# EAGLE design 2020can_master_v4 (EAGLE 9.6.2)
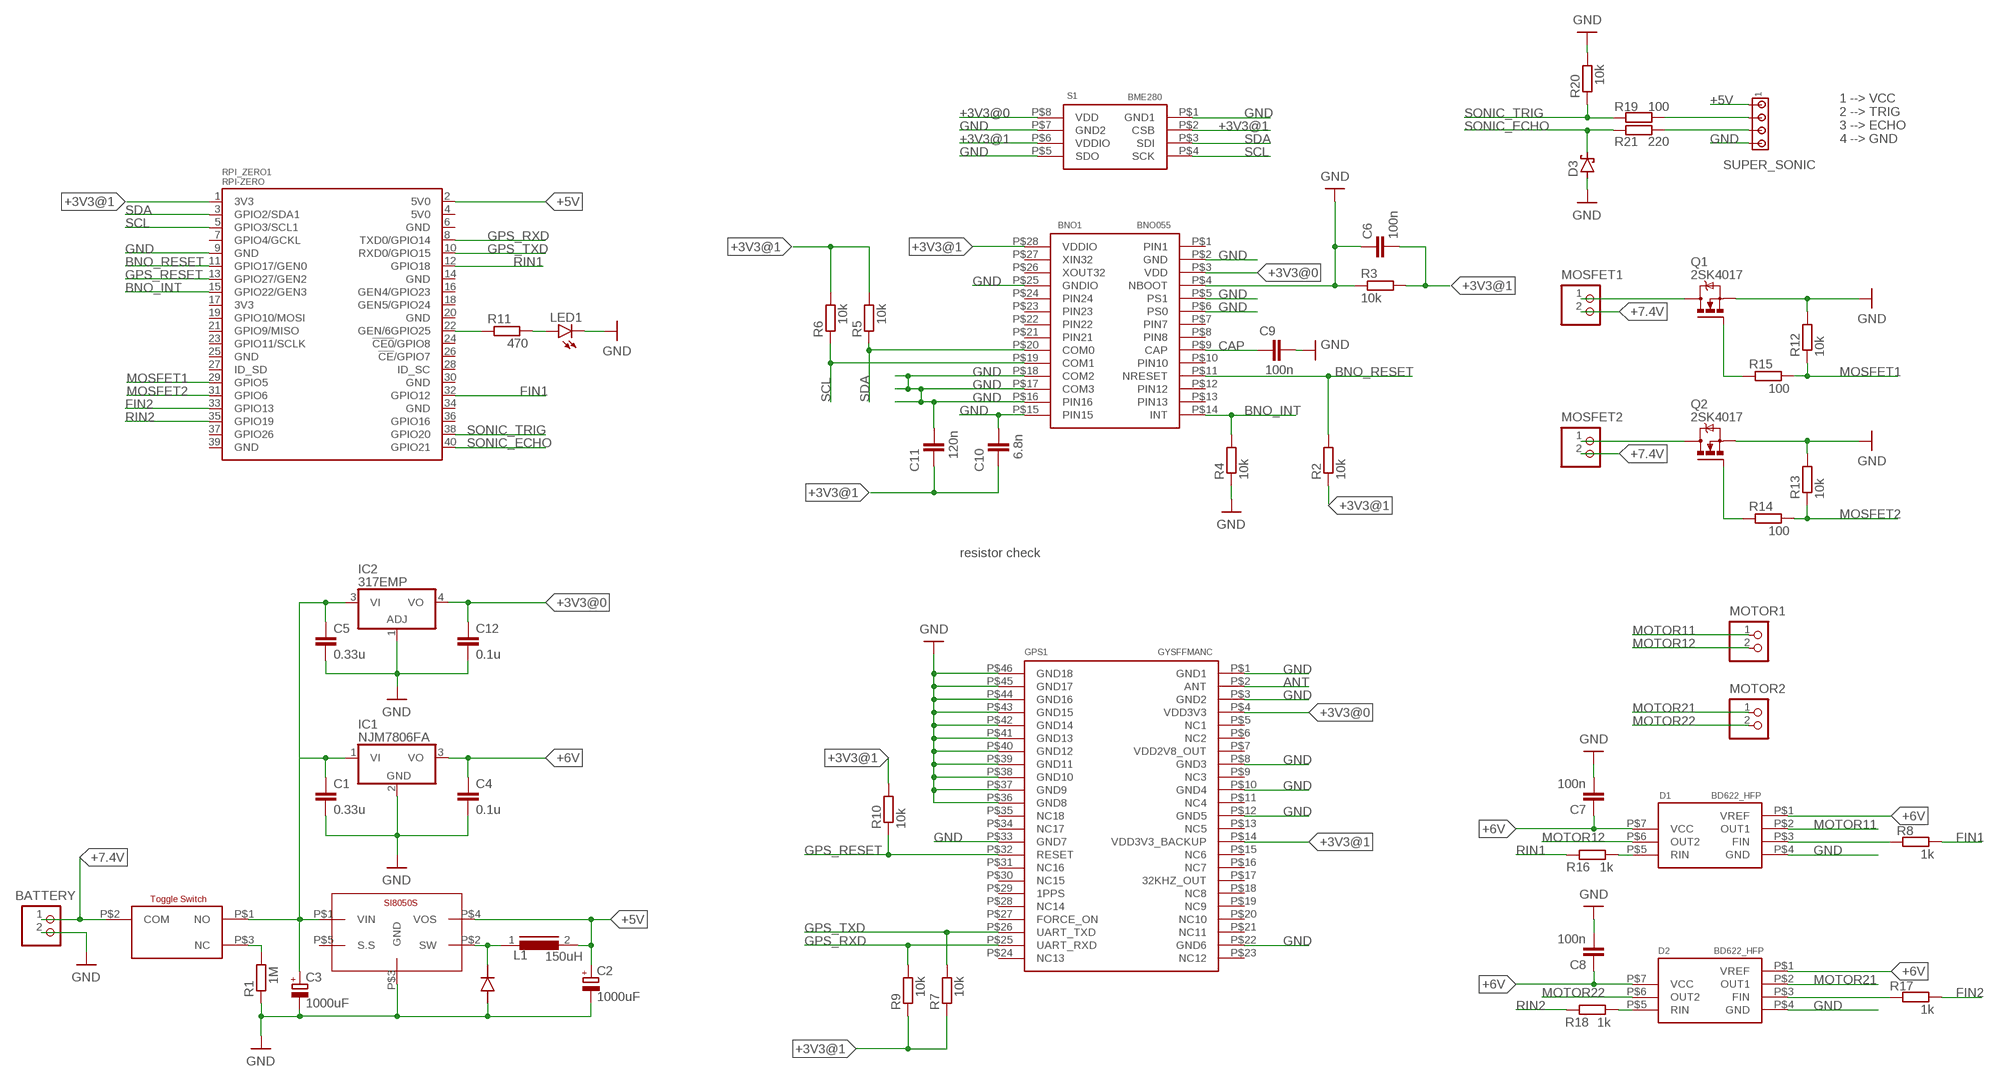
[diagram p0: schematic, sheet 1]

## Parts
BATTERY  B2P-VH  [B2P-VH]
BNO1  BNO055  [BNO055]
C1  0.33u  C5/3  [C5B3]
C2  1000uF  CPOL-EUE5-10.5  [E5-10,5]
C3  1000uF  CPOL-EUE5-10.5  [E5-10,5]
C4  0.1u  C5/3  [C5B3]
C5  0.33u  C5/3  [C5B3]
C6  100n  C-EUC1206  [C1206]
C7  100n  C-EUC1206  [C1206]
C8  100n  C-EUC1206  [C1206]
C9  100n  C-EUC1206  [C1206]
C10  6.8n  C-EUC1206  [C1206]
C11  120n  C-EUC1206  [C1206]
C12  0.1u  C5/3  [C5B3]
D1  BD622_HFP  [BD62**_HRP7]
D2  BD622_HFP  [BD62**_HRP7]
D3  15KEXXD  [DO201T15]
DIODE_1.1  DIODE_1.5  [DIODE_1.5]
GPS1  GYSFFMANC  [GYSFFMANC]
IC1  NJM7806FA  786TV  [TO220V]
IC2  317EMP  [SOT223]
L1  150uH  SFT830D  [SFT830D]
LED1  LED5MM  [LED5MM]
MOSFET1  B2P-VH  [B2P-VH]
MOSFET2  B2P-VH  [B2P-VH]
MOTOR1  B2P-VH  [B2P-VH]
MOTOR2  B2P-VH  [B2P-VH]
Q1  2SK4017  IRF520  [TO220BV]
Q2  2SK4017  IRF520  [TO220BV]
R1  1M  R-EU_R1206  [R1206]
R2  10k  R-EU_R1206  [R1206]
R3  10k  R-EU_R1206  [R1206]
R4  10k  R-EU_R1206  [R1206]
R5  10k  R-EU_R1206  [R1206]
R6  10k  R-EU_R1206  [R1206]
R7  10k  R-EU_R1206  [R1206]
R8  1k  R-EU_R1206  [R1206]
R9  10k  R-EU_R1206  [R1206]
R10  10k  R-EU_R1206  [R1206]
R11  470  R-EU_0207/10  [0207/10]
R12  10k  R-EU_R1206  [R1206]
R13  10k  R-EU_R1206  [R1206]
R14  100  R-EU_0207/10  [0207/10]
R15  100  R-EU_0207/10  [0207/10]
R16  1k  R-EU_R1206  [R1206]
R17  1k  R-EU_R1206  [R1206]
R18  1k  R-EU_R1206  [R1206]
R19  100  R-EU_0207/10  [0207/10]
R20  10k  R-EU_R1206  [R1206]
R21  220  R-EU_0207/10  [0207/10]
RPI_ZERO1  RPI-ZERO  [RASP_PI_ZERO_BOARD_FULL]
S1  BME280  [BME280]
SI8050S1  SI8050S  [SI8050S]
SUPER_SONIC  MTA04-100  [10X04MTA]
SWITCH_2MS1T2B4M2QES1  SWITCH_2MS1T2B4M2QES  [SWITCH_2MS1T2B4M2QES]

## Nets
+3V3@0: BNO1.P$3(VDD) C12.1 GPS1.P$4(VDD3V3) IC2.4(VO) S1.P$8(VDD)
+3V3@1: BNO1.P$28(VDDIO) C6.2 C10.1 C11.1 GPS1.P$14(VDD3V3_BACKUP) R2.1 R3.2 R5.2 R6.2 R7.1 R9.1 R10.2 RPI_ZERO1.1(3V3) S1.P$2(CSB) S1.P$6(VDDIO)
+5V [power]: C2.+ L1.2 RPI_ZERO1.2(5V0) SI8050S1.P$4(VOS) SUPER_SONIC.1
+6V [motor]: C4.1 C7.1 C8.1 D1.P$1(VREF) D1.P$7(VCC) D2.P$1(VREF) D2.P$7(VCC) IC1.3(VO)
+7.4V [power]: BATTERY.1 MOSFET1.2 MOSFET2.2 SWITCH_2MS1T2B4M2QES1.P$2(COM)
ANT [signal]: GPS1.P$2(ANT)
BNO_INT [signal]: BNO1.P$14(INT) R4.2 RPI_ZERO1.15(GPIO22/GEN3)
BNO_RESET [signal]: BNO1.P$11(NRESET) R2.2 RPI_ZERO1.11(GPIO17/GEN0)
CAP [signal]: BNO1.P$9(CAP) C9.1
FIN1 [signal]: R8.1 RPI_ZERO1.32(GPIO12)
FIN2 [signal]: R17.1 RPI_ZERO1.33(GPIO13)
GND: BATTERY.2 BNO1.P$2(GND) BNO1.P$4(NBOOT) BNO1.P$5(PS1) BNO1.P$6(PS0) BNO1.P$15(PIN15) BNO1.P$16(PIN16) BNO1.P$17(COM3) BNO1.P$18(COM2) BNO1.P$25(GNDIO) C1.2 C2.- C3.- C4.2 C5.2 C6.1 C7.2 C8.2 C9.2 C10.2 C11.2 C12.2 D1.P$4(GND) D2.P$4(GND) D3.A DIODE_1.1.P$1(ANODE) GPS1.P$1(GND1) GPS1.P$3(GND2) GPS1.P$8(GND3) GPS1.P$10(GND4) GPS1.P$12(GND5) GPS1.P$22(GND6) GPS1.P$33(GND7) GPS1.P$36(GND8) GPS1.P$37(GND9) GPS1.P$38(GND10) GPS1.P$39(GND11) GPS1.P$40(GND12) GPS1.P$41(GND13) GPS1.P$42(GND14) GPS1.P$43(GND15) GPS1.P$44(GND16) GPS1.P$45(GND17) GPS1.P$46(GND18) IC1.2(GND) IC2.1(ADJ) LED1.K(C) Q1.S Q2.S R1.1 R3.1 R4.1 R12.2 R13.2 R20.2 RPI_ZERO1.9(GND) S1.P$1(GND1) S1.P$5(SDO) S1.P$7(GND2) SI8050S1.P$3(GND) SUPER_SONIC.4
GPS_RESET [signal]: GPS1.P$32(RESET) R10.1 RPI_ZERO1.13(GPIO27/GEN2)
GPS_RXD [signal]: GPS1.P$25(UART_RXD) R9.2 RPI_ZERO1.8(TXD0/GPIO14)
GPS_TXD [signal]: GPS1.P$26(UART_TXD) R7.2 RPI_ZERO1.10(RXD0/GPIO15)
MOSFET1: R12.1 R15.2 RPI_ZERO1.29(GPIO5)
MOSFET2: R13.1 R14.2 RPI_ZERO1.31(GPIO6)
MOTOR11 [motor]: D1.P$2(OUT1) MOTOR1.1
MOTOR12 [motor]: D1.P$6(OUT2) MOTOR1.2
MOTOR21 [motor]: D2.P$2(OUT1) MOTOR2.1
MOTOR22 [motor]: D2.P$6(OUT2) MOTOR2.2
N$1: R1.2 SWITCH_2MS1T2B4M2QES1.P$3(NC)
N$2 [motor]: DIODE_1.1.P$2(CATHODE) L1.1 SI8050S1.P$2(SW)
N$3 [signal]: R11.1 RPI_ZERO1.22(GEN/6GPIO25)
N$4 [power]: C1.1 C3.+ C5.1 IC1.1(VI) IC2.3(VI) SI8050S1.P$1(VIN) SWITCH_2MS1T2B4M2QES1.P$1(NO)
N$5 [signal]: LED1.A R11.2
N$6: MOSFET1.1 Q1.D
N$7: D1.P$3(FIN) R8.2
N$8: MOSFET2.1 Q2.D
N$9: D1.P$5(RIN) R16.1
N$10: Q1.G R15.1
N$11: Q2.G R14.1
N$12: D2.P$3(FIN) R17.2
N$14: D2.P$5(RIN) R18.1
N$15: R19.2 SUPER_SONIC.2
N$16: R21.2 SUPER_SONIC.3
RIN1 [signal]: R16.2 RPI_ZERO1.12(GPIO18)
RIN2 [signal]: R18.2 RPI_ZERO1.35(GPIO19)
SCL [signal]: BNO1.P$19(COM1) R6.1 RPI_ZERO1.5(GPIO3/SCL1) S1.P$4(SCK)
SDA [signal]: BNO1.P$20(COM0) R5.1 RPI_ZERO1.3(GPIO2/SDA1) S1.P$3(SDI)
SONIC_ECHO: D3.C R21.1 RPI_ZERO1.40(GPIO21)
SONIC_TRIG: R19.1 R20.1 RPI_ZERO1.38(GPIO20)
Unconnected: BNO1.P$1(PIN1) BNO1.P$7(PIN7) BNO1.P$8(PIN8) BNO1.P$10(PIN10) BNO1.P$12(PIN12) BNO1.P$13(PIN13) BNO1.P$21(PIN21) BNO1.P$22(PIN22) BNO1.P$23(PIN23) BNO1.P$24(PIN24) BNO1.P$26(XOUT32) BNO1.P$27(XIN32) GPS1.P$5(NC1) GPS1.P$6(NC2) GPS1.P$7(VDD2V8_OUT) GPS1.P$9(NC3) GPS1.P$11(NC4) GPS1.P$13(NC5) GPS1.P$15(NC6) GPS1.P$16(NC7) GPS1.P$17(32KHZ_OUT) GPS1.P$18(NC8) GPS1.P$19(NC9) GPS1.P$20(NC10) GPS1.P$21(NC11) GPS1.P$23(NC12) GPS1.P$24(NC13) GPS1.P$27(FORCE_ON) GPS1.P$28(NC14) GPS1.P$29(1PPS) GPS1.P$30(NC15) GPS1.P$31(NC16) GPS1.P$34(NC17) GPS1.P$35(NC18) RPI_ZERO1.4(5V0) RPI_ZERO1.6(GND) RPI_ZERO1.7(GPIO4/GCKL) RPI_ZERO1.14(GND) RPI_ZERO1.16(GEN4/GPIO23) RPI_ZERO1.17(3V3) RPI_ZERO1.18(GEN5/GPIO24) RPI_ZERO1.19(GPIO10/MOSI) RPI_ZERO1.20(GND) RPI_ZERO1.21(GPIO9/MISO) RPI_ZERO1.23(GPIO11/SCLK) RPI_ZERO1.24(!CE0!/GPIO8) RPI_ZERO1.25(GND) RPI_ZERO1.26(!CE!/GPIO7) RPI_ZERO1.27(ID_SD) RPI_ZERO1.28(ID_SC) RPI_ZERO1.30(GND) RPI_ZERO1.34(GND) RPI_ZERO1.36(GPIO16) RPI_ZERO1.37(GPIO26) RPI_ZERO1.39(GND) SI8050S1.P$5(S.S)

## Notes on the sheet
- 1 --> VCC
  2 --> TRIG
  3 --> ECHO
  4 --> GND
- resistor check

## Library data of the parts
BATTERY MOSFET1 MOSFET2 MOTOR1 MOTOR2 = CONN_VH:B2P-VH: Wire-to-Board 3.96mm pitch top mount connector Source: http://www.jst-mfg.com/product/pdf/jpn/VH.pdf http://www.jst-mfg.com/product/detail.php?series=262
BNO1 = BNO055:BNO055
C1 C4 C5 C12 = capacitor-wima:C: CAPACITOR naming: grid - package width
C2 C3 = resistor:CPOL-EU: POLARIZED CAPACITOR, European symbol
C6-C11 = rcl:C-EU: CAPACITOR, European symbol; SPICEPREFIX: C
D1 D2 = BD62_:BD622*_HFP
D3 = diode:15KEXXD: DIODE
DIODE_1.1 = diode_1.5mm:DIODE_1.5
GPS1 = GPS:GYSFFMANC
IC1 = linear:78*: Positive VOLTAGE REGULATOR Source: http://cache.national.com/ds/LM/LM78L05.pdf http://www.fairchildsemi.com/ds/LM/LM7805.pdf
IC2 = linear:*317: Positive VOLTAGE REGULATOR
L1 = inductors:SFT830D: INDUCTOR; SPICEPREFIX: L
LED1 = led:LED: LED OSRAM: - CHIPLED LG R971, LG N971, LY N971, LG Q971, LY Q971, LO R971, LY R971 LH N974, LH R974 LS Q976, LO Q976, LY Q976 LO Q996 - Hyper CHIPLED LW Q18S LB Q993, LB Q99A, LB R99A - SideLED LS A670, LO A670, LY A670, LG A670, LP A670 LB A673, LV A673, LT A673, LW A673 LH A674 LY A675 LS A676, LA A676, LO A676, LY A676, LW A676 LS A679, LY A679, LG A679 - Hyper Micro SIDELED® LS Y876, LA Y876, LO Y876, LY Y876 LT Y87S - SmartLED LW L88C, LW L88S LB L89C, LB L89S, LG L890 LS L89K, LO L89K, LY L89K LS L896, LA L896, LO L896, LY L896 - TOPLED LS T670, LO T670, LY T670, LG T670, LP T670 LSG T670, LSP T670, LSY T670, LOP T670, LYG T670 LG T671, LOG T671, LSG T671 LB T673, LV T673, LT T673, LW T673 LH T674 LS T676, LA T676, LO T676, LY T676, LB T676, LH T676, LSB T676, LW T676 LB T67C, LV T67C, LT T67C, LS T67K, LO T67K, LY T67K, LW E67C LS E67B, LA E67B, LO E67B, LY E67B, LB E67C, LV E67C, LT E67C LW T67C LS T679, LY T679, LG T679 LS T770, LO T770, LY T770, LG T770, LP T770 LB T773, LV T773, LT T773, LW T773 LH T774 LS E675, LA E675, LY E675, LS T675 LS T776, LA T776, LO T776, LY T776, LB T776 LHGB T686 LT T68C, LB T68C - Hyper Mini TOPLED® LB M676 - Mini TOPLED Santana® LG M470 LS M47K, LO M47K, LY M47K Source: http://www.osram.convergy.de LUXEON: - LUMILED® LXK2-PW12-R00, LXK2-PW12-S00, LXK2-PW14-U00, LXK2-PW14-V00 LXK2-PM12-R00, LXK2-PM12-S00, LXK2-PM14-U00 LXK2-PE12-Q00, LXK2-PE12-R00, LXK2-PE12-S00, LXK2-PE14-T00, LXK2-PE14-U00 LXK2-PB12-K00, LXK2-PB12-L00, LXK2-PB12-M00, LXK2-PB14-N00, LXK2-PB14-P00, LXK2-PB14-Q00 LXK2-PR12-L00, LXK2-PR12-M00, LXK2-PR14-Q00, LXK2-PR14-R00 LXK2-PD12-Q00, LXK2-PD12-R00, LXK2-PD12-S00 LXK2-PH12-R00, LXK2-PH12-S00 LXK2-PL12-P00, LXK2-PL12-Q00, LXK2-PL12-R00 Source: www.luxeon.com KINGBRIGHT: KA-3528ASYC Source: www.kingbright.com
Q1 Q2 = transistor-power:IRF520: HEXFET Power MOSFET
R1-R21 = rcl:R-EU_: RESISTOR, European symbol; SPICEPREFIX: R
RPI_ZERO1 = RaspberryPi_Zero:RPI-ZERO: MICON
S1 = BME280:BME280
SI8050S1 = SI-8050S:SI8050S
SUPER_SONIC = con-amp:MTA04-100: AMP connector
SWITCH_2MS1T2B4M2QES1 = switch_2MS1T2B4M2QES:SWITCH_2MS1T2B4M2QES

## Net classes
0 default: width 0.2 mm, clearance 0.05 mm
1 power: width 1.5 mm, clearance 0.2 mm
2 mos: width 1.5 mm, clearance 0.2 mm
3 signal: width 0.2 mm, clearance 0.05 mm
4 motor: width 0.8 mm, clearance 0.1 mm

## Board
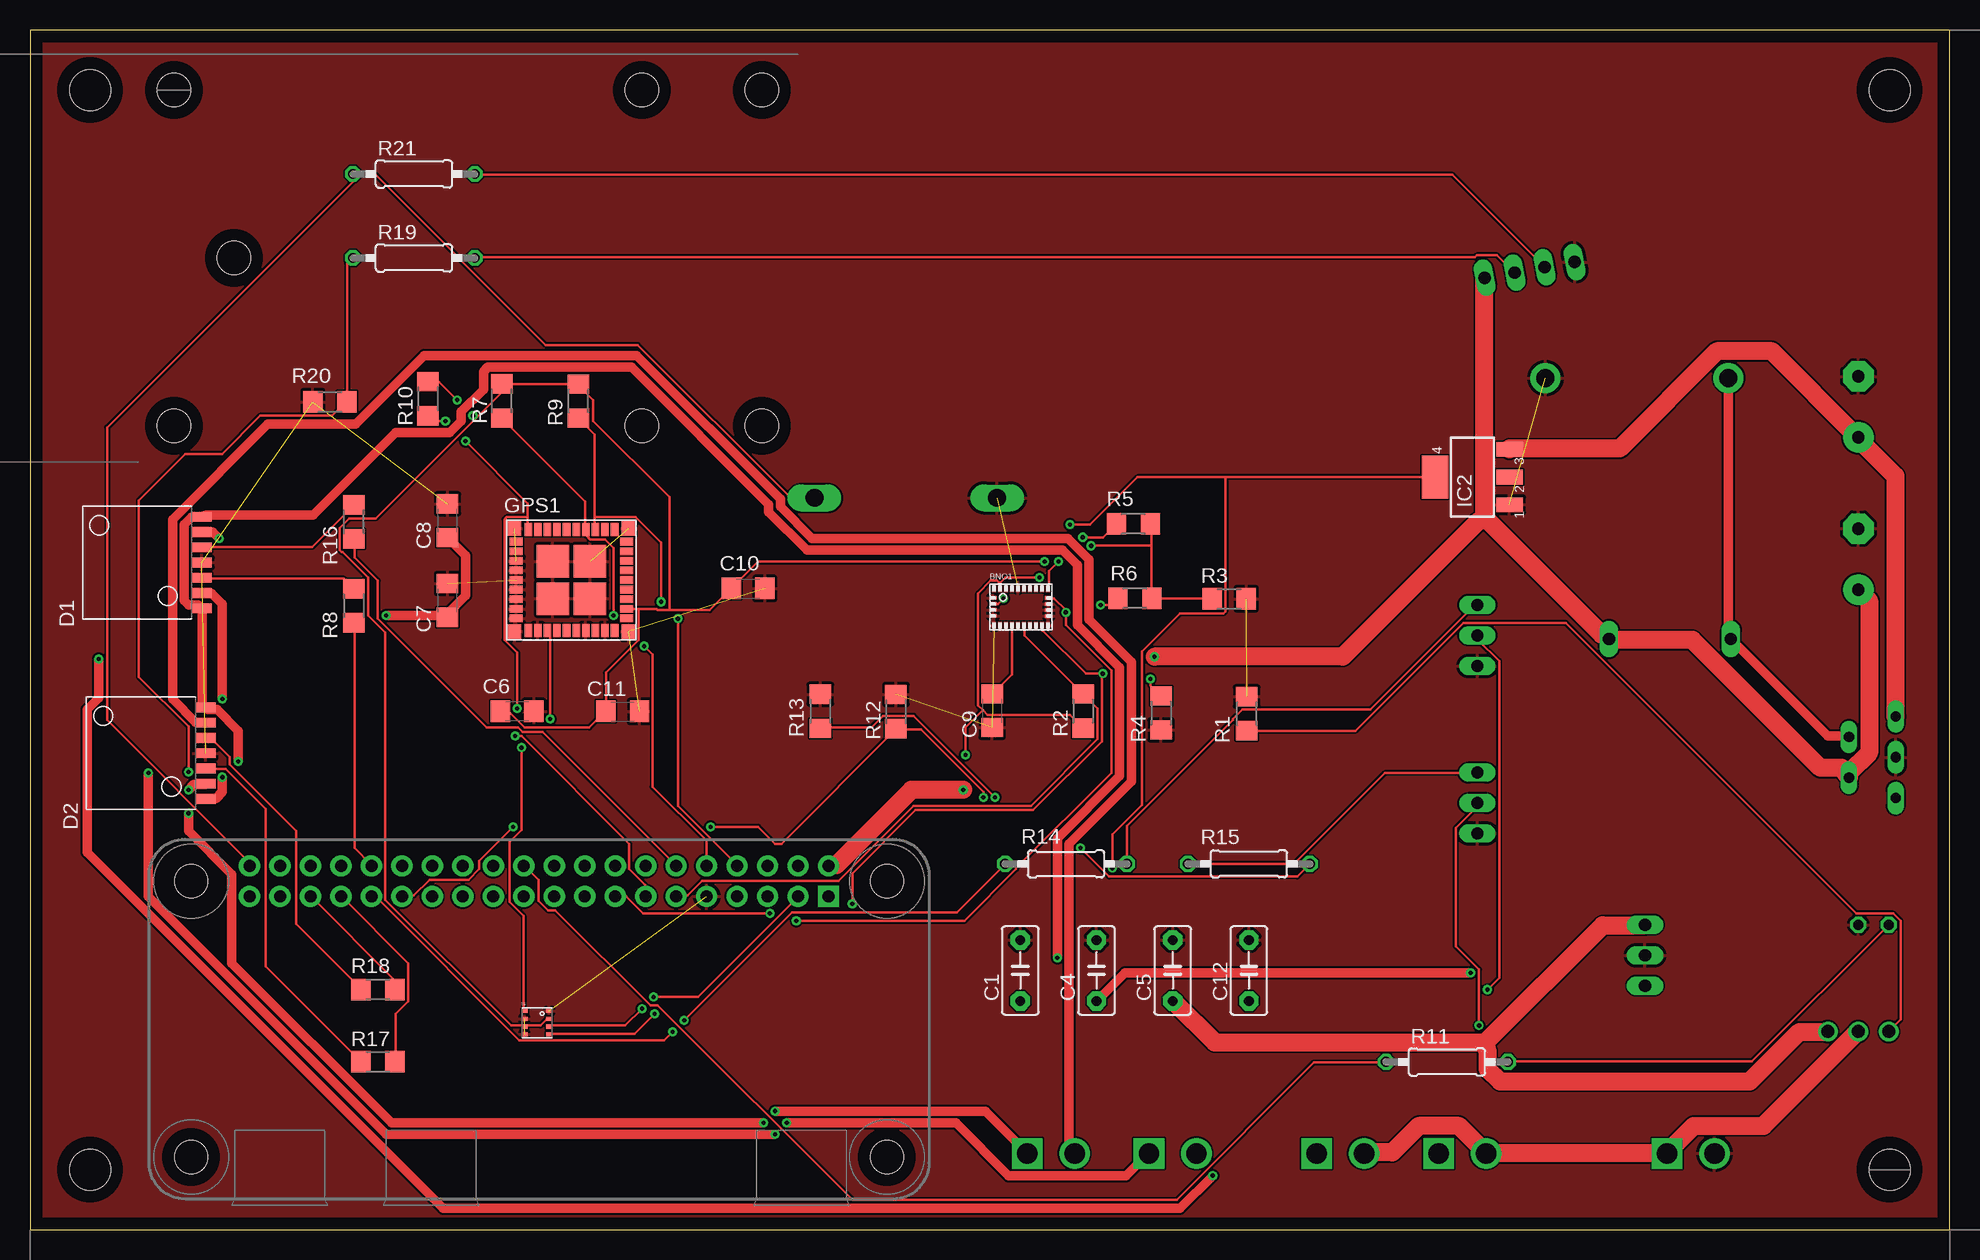
[diagram p1: board, top side]
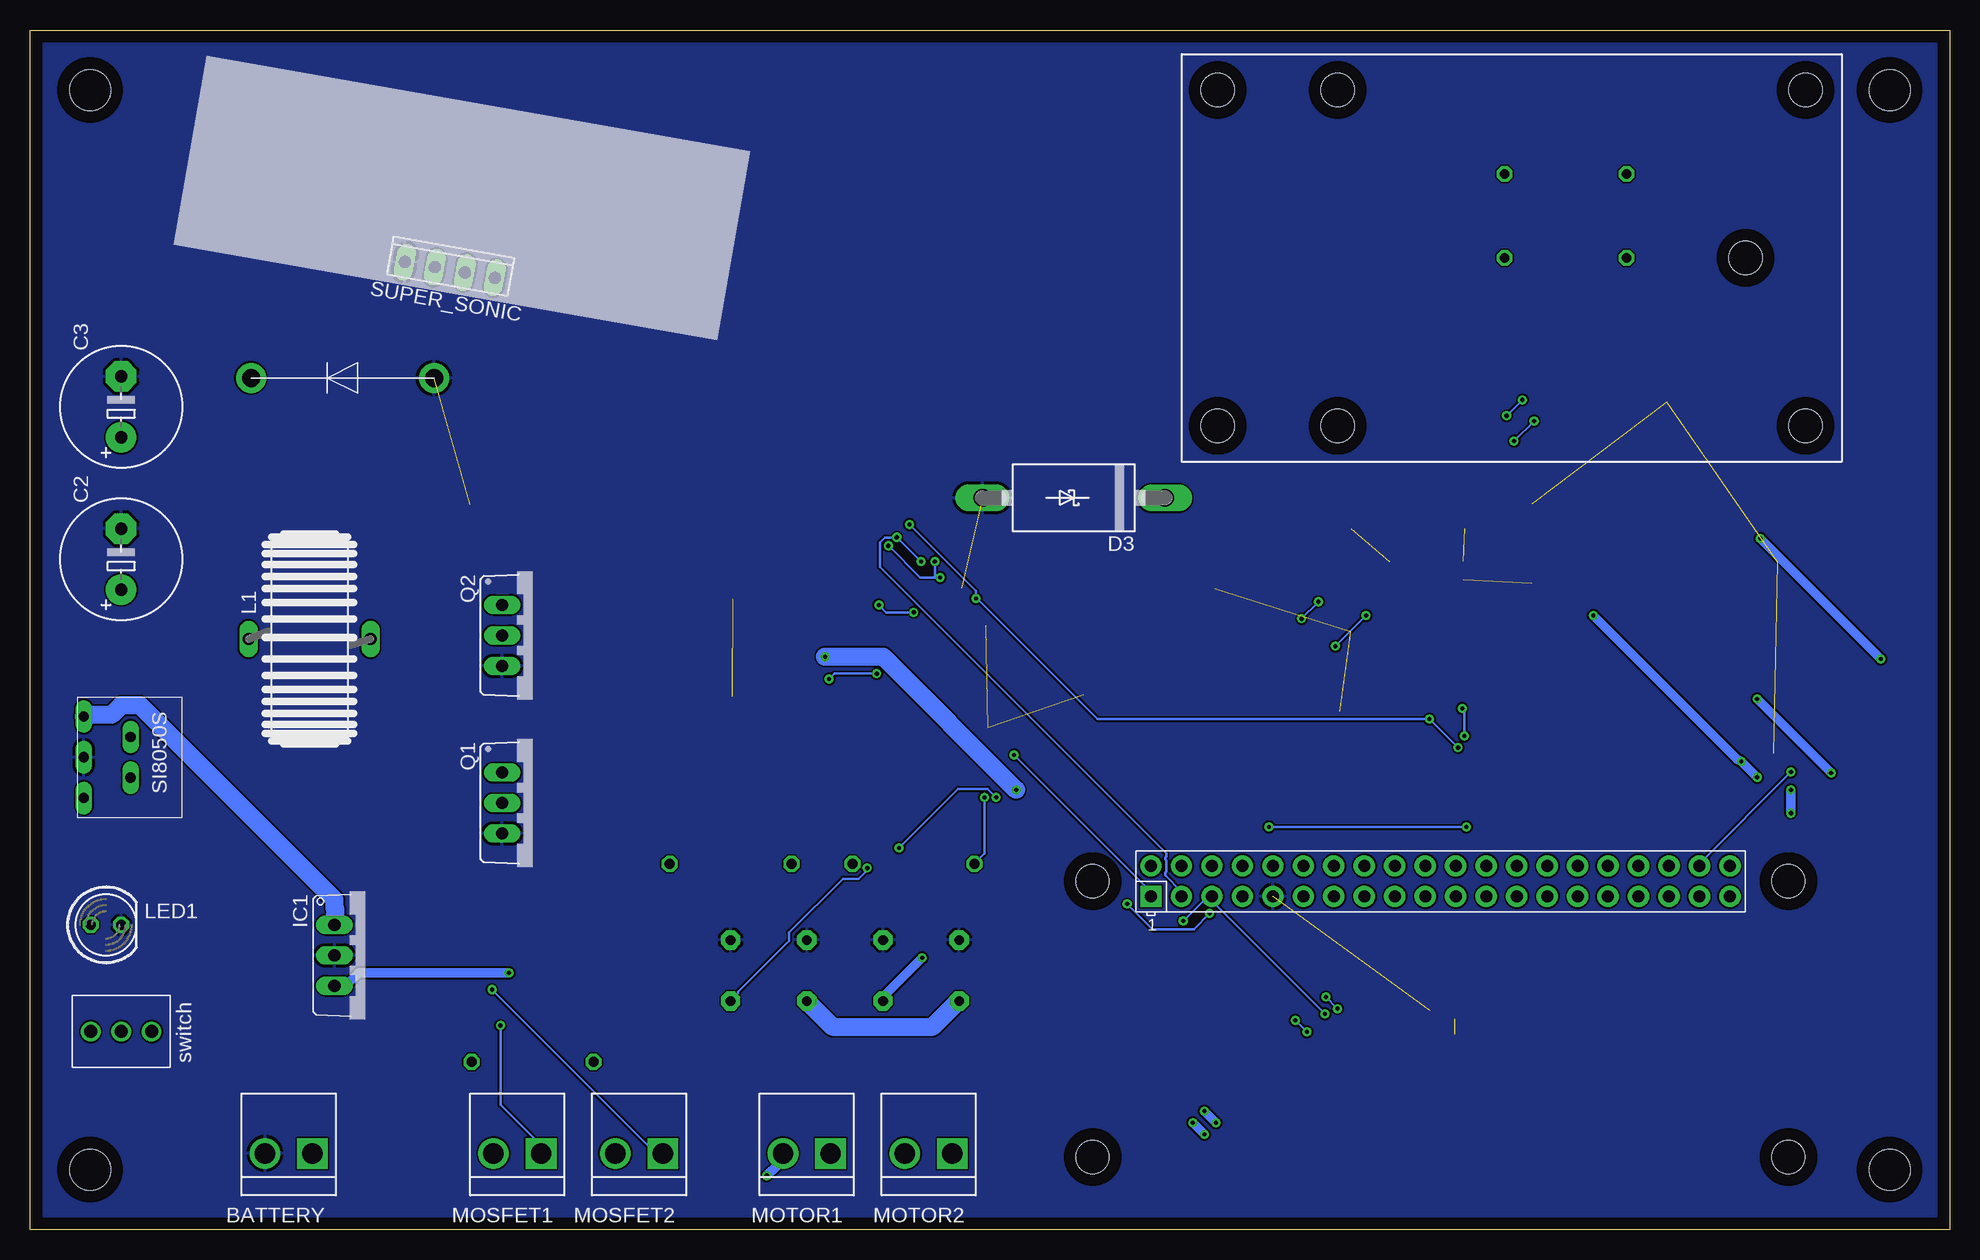
[diagram p2: board, bottom side, seen from below]

Size 160 x 100 mm. Coordinates in mm from the lower left corner, seen from the top.
Outline: 0,0 160,0 160,100 0,100 0,0
Copper layers (1*16): Top 0.035mm / dielectric 1.5mm / Bottom 0.035mm
Design rules "default": minimum track width 6mil, minimum drill 0.35mm, track to track 6mil, track to pad 6mil, pad to pad 6mil, via to via 6mil, smd to smd 6mil, copper to edge 40mil, drill to drill 6mil, minimum pad ring 10mil, minimum via ring 8mil, stop-mask expansion 4mil, vias tented up to drill 0mil, thermal gap 10mil
Holes 3.4 mm at 5,5 5,95 155,5 155,95
Holes 2.8 mm at 12,67 12,95 51,95 61,95 61,67 51,67 17,81

### Footprints (pad centres in the part's own frame; a part is rotated, then mirrored left to right if it is on the bottom)
B2P-VH = drill 1.7 square: 1 -1.98,0 | drill 1.7: 2 1.98,0
BNO055 = smd 0.305 x 0.61: P$1 0.35,3.47; P$6 0.355,0.35; P$7 0.855,0.35; P$8 1.355,0.35; P$9 1.855,0.35; P$10 2.355,0.35; P$11 2.855,0.35; P$12 3.355,0.35; P$13 3.855,0.35; P$14 4.355,0.35; P$15 4.855,0.35; P$20 4.85,3.47; P$21 4.35,3.47; P$22 3.85,3.47; P$23 3.35,3.47; P$24 2.85,3.47; P$25 2.35,3.47; P$26 1.85,3.47; P$27 1.35,3.47; P$28 0.85,3.47 | smd 0.61 x 0.305: P$2 0.275,2.655; P$3 0.275,2.155; P$4 0.275,1.655; P$5 0.275,1.155; P$16 4.915,1.15; P$17 4.915,1.65; P$18 4.915,2.15; P$19 4.915,2.65
C5B3 = drill 0.813 pad 1.6 octagon: 1 -2.54,0; 2 2.54,0
E5-10,5 = drill 1.016 pad 2.54: + -2.54,0 | drill 1.016 pad 2.54 octagon: - 2.54,0
C1206 = smd 1.6 x 1.8: 1 -1.4,0; 2 1.4,0
BD62**_HRP7 = smd 0.813 x 1.676: P$1 0.887,-0.835; P$2 2.158,-0.835; P$3 3.428,-0.835; P$4 4.697,-0.835; P$5 5.968,-0.835; P$6 7.237,-0.835; P$7 8.508,-0.835
DO201T15 = drill 1.499 long: A 7.62,0; C -7.62,0
DIODE_1.5 = drill 1.5 pad 2.5: P$1 -7.62,0; P$2 7.62,0
GYSFFMANC = smd 1.2 x 1.1: P$1 0.7,10.15; P$12 0.7,0.65; P$22 9.3,0.65; P$33 9.3,10.15 | smd 1.1 x 0.635: P$2 0.8,9; P$3 0.8,8.2; P$4 0.8,7.4; P$5 0.8,6.6; P$6 0.8,5.8; P$7 0.8,5; P$8 0.8,4.2; P$9 0.8,3.4; P$10 0.8,2.6; P$11 0.8,1.8; P$23 9.2,1.8; P$24 9.2,2.6; P$25 9.2,3.4; P$26 9.2,4.2; P$27 9.2,5; P$28 9.2,5.8; P$29 9.2,6.6; P$30 9.2,7.4; P$31 9.2,8.2; P$32 9.2,9 | smd 0.635 x 1.1: P$13 1.8,0.8; P$14 2.6,0.8; P$15 3.4,0.8; P$16 4.2,0.8; P$17 5,0.8; P$18 5.8,0.8; P$19 6.6,0.8; P$20 7.4,0.8; P$21 8.2,0.8; P$34 8.2,10; P$35 7.4,10; P$36 6.6,10; P$37 5.8,10; P$38 5,10; P$39 4.2,10; P$40 3.4,10; P$41 2.6,10; P$42 1.8,10 | smd 2.7 x 2.7: P$43 3.45,6.95; P$44 3.45,3.85; P$45 6.55,3.85; P$46 6.55,6.95
TO220V = drill 1.016 long: 1 -2.54,-2.54; 2 0,-2.54; 3 2.54,-2.54
SOT223 = smd 1.219 x 2.235: 1 -2.311,-3.099; 2 0,-3.099; 3 2.311,-3.099 | smd 3.6 x 2.2: 4 0,3.099
SFT830D = drill 1.016 long: 1 -5.08,0; 2 5.08,0
LED5MM = drill 0.813 octagon: A -1.27,0; K 1.27,0
TO220BV = drill 1.016 long: D 0,-2.54; G -2.54,-2.54; S 2.54,-2.54
R1206 = smd 1.6 x 1.803: 1 -1.422,0; 2 1.422,0
0207/10 = drill 0.813 octagon: 1 -5.08,0; 2 5.08,0
RASP_PI_ZERO_BOARD_FULL = drill 1 pad 1.778 square: 1 8.37,25.23 | drill 1 pad 1.778: 2 8.37,27.77; 3 10.91,25.23; 4 10.91,27.77; 5 13.45,25.23; 6 13.45,27.77; 7 15.99,25.23; 8 15.99,27.77; 9 18.53,25.23; 10 18.53,27.77; 11 21.07,25.23; 12 21.07,27.77; 13 23.61,25.23; 14 23.61,27.77; 15 26.15,25.23; 16 26.15,27.77; 17 28.69,25.23; 18 28.69,27.77; 19 31.23,25.23; 20 31.23,27.77; 21 33.77,25.23; 22 33.77,27.77; 23 36.31,25.23; 24 36.31,27.77; 25 38.85,25.23; 26 38.85,27.77; 27 41.39,25.23; 28 41.39,27.77; 29 43.93,25.23; 30 43.93,27.77; 31 46.47,25.23; 32 46.47,27.77; 33 49.01,25.23; 34 49.01,27.77; 35 51.55,25.23; 36 51.55,27.77; 37 54.09,25.23; 38 54.09,27.77; 39 56.63,25.23; 40 56.63,27.77 | hole 2.75: 3.5,3.5; 3.5,26.5; 61.5,3.5; 61.5,26.5
BME280 = smd 0.5 x 0.35: P$1 2.275,2.225; P$2 2.275,1.575; P$3 2.275,0.925; P$4 2.275,0.275; P$5 0.225,0.275; P$6 0.225,0.925; P$7 0.225,1.575; P$8 0.225,2.225
SI8050S = drill 0.85 pad 0.9 long: P$1 -3.4,-8.2; P$2 -1.7,-4.3; P$3 0,-8.2; P$4 1.7,-4.3; P$5 3.4,-8.2
10X04MTA = drill 1.016 long: 1 3.81,0; 2 1.27,0; 3 -1.27,0; 4 -3.81,0
SWITCH_2MS1T2B4M2QES = drill 1.09: P$1 0,2.54; P$2 0,0; P$3 0,-2.54

### Placement (x,y rotation side)
BATTERY  138.43,6.35 180 bottom
BNO1  80,50 0 top
C1  82.55,21.59 90 top
C2  152.4,55.88 90 bottom
C3  152.4,68.58 90 bottom
C4  88.9,21.59 90 top
C5  95.25,21.59 90 top
C6  40.6,43.2 180 top
C7  34.8,52.45 90 top
C8  34.8,59.1 90 top
C9  80.2,43.25 270 top
C10  59.85,53.45 0 top
C11  49.4,43.2 0 top
C12  101.6,21.59 90 top
D1  13.48,50.91 90 top
D2  13.8,35.01 90 top
D3  73,61 180 bottom
DIODE_1.1  133.95,70.99 180 bottom
GPS1  50.53,49.15 90 top
IC1  132.08,22.86 270 bottom
IC2  120.23,62.73 90 top
L1  136.7,49.23 0 bottom
LED1  153.67,25.4 0 bottom
MOSFET1  119.38,6.35 180 bottom
MOSFET2  109.22,6.35 180 bottom
MOTOR1  95.25,6.35 180 bottom
MOTOR2  85.09,6.35 180 bottom
Q1  118.11,35.56 270 bottom
Q2  118.11,49.53 270 bottom
R1  101.42,43 270 top
R2  87.78,43.22 90 top
R3  99.96,52.58 180 top
R4  94.28,43.06 90 top
R5  91.98,58.82 0 top
R6  92.1,52.62 0 top
R7  39.32,69.08 270 top
R8  27,52 90 top
R9  45.72,69.06 270 top
R10  33.18,69.26 90 top
R11  118.11,13.97 0 top
R12  72.18,43.18 90 top
R13  65.88,43.2 90 top
R14  86.36,30.48 180 top
R15  101.6,30.48 0 top
R16  27,59 270 top
R17  29,14 180 top
R18  29,20 0 top
R19  32,81 0 top
R20  25,69 180 top
R21  32,88 0 top
RPI_ZERO1  74.93,2.54 0 bottom
S1  41,16 0 top
SI8050S1  147.32,39.37 270 bottom
SUPER_SONIC  125,80 350 bottom
SWITCH_2MS1T2B4M2QES1  152.4,16.51 270 bottom

### Tracks (layer width: path | path; a pad name or v marks a point on that pad's centre or on a via)
+3V3@0  (via drill 0.35)
  Top 0.2: v40.97,40.17 40.97,33.3 40,32.33 40,27.31 41.14,26.17 41.14,18.24 S1.P$8 | v43.34,42.55 43.34,49.69 43.17,49.87 GPS1.P$4 | v81.14,52.6 80.7,52.16 80.35,52.16 BNO1.P$3 | v86.69,58.76 88.36,58.76 92.33,62.73 99.64,62.73 | 99.64,62.73 117.08,62.73 IC2.4 | v90.21,30.13 90.21,32.95 92.68,35.42 92.68,48.19 95.85,51.36 99.47,51.36 99.64,51.54 99.64,62.73
  Bottom 0.2: v40.97,40.17 v43.34,42.55 71.01,42.55 81.05,52.6 v81.14,52.6 81.14,53.21 v86.69,58.76 | v90.21,30.13 90.21,29.95 90.92,29.25 92.24,29.25 96.73,24.76 96.73,24.05 100.96,19.82 100.96,19.73 101.58,19.12 C12.1
+3V3@1  (via drill 0.35)
  Top 0.2: R3.2 98.5,52.6 93.56,52.6 R6.2 93.47,52.68 93.47,57 | 93.47,57 93.47,58.76 R5.2 | 80.79,53.92 80.79,53.48 BNO1.P$28 | 80.79,53.92 80.61,54.09 80.08,54.09 79.03,53.04 79.03,43.7 79.42,43.3 | 79.42,43.3 79.82,42.91 86.69,42.91 87.75,41.85 R2.1 | v77.97,39.56 77.97,41.85 79.42,43.3 | v88.45,57 93.47,57 | v84.14,54.36 81.32,54.36 80.88,53.92 80.79,53.92 | C6.2 39.2,43.17 39.91,43.17 41.23,41.85 46.6,41.85 47.93,43.17 C11.1 48.01,43.26 48.01,46.43 50.75,49.16 50.75,51.72 | 50.75,51.72 52.24,51.72 52.33,51.63 53.3,51.63 | 50.75,51.72 49.78,51.72 GPS1.P$14 | 53.3,51.63 56.65,51.63 58.41,53.39 C10.1 58.5,53.48 60.7,55.68 v84.58,55.68 | S1.P$2 43.26,17.53 43.08,17.53 42.55,17 41.23,17 S1.P$6 41.14,17 40.09,17 29.6,27.49 29.6,49.78 28.19,51.19 28.19,54.36 26.08,56.47 25.99,56.47 25.81,56.65 25.81,58.5 26.61,59.29 28.81,59.29 37.13,67.62 | 37.13,67.62 39.29,69.78 39.29,70.48 R7.1 39.38,70.48 45.64,70.48 R9.1 45.72,70.39 46.96,69.16 46.96,67.4 53.3,61.05 53.3,51.63 | v35.59,69.16 34.09,70.66 33.21,70.66 R10.2 | 37.13,67.62 v36.91,67.84
  Bottom 0.2: v77.97,39.56 66.6,28.19 66.6,27.84 RPI_ZERO1.1 | v88.45,57 85.81,54.36 84.58,54.36 | v84.14,54.36 84.58,54.36 | v36.91,67.84 v35.59,69.16 | v84.58,55.68 84.58,54.36
+5V  (via drill 0.35)
  Top 1.5: C2.+ 152.41,53.3 153.29,52.42 153.29,39.73 151.62,38.06 151.62,37.71 SI8050S1.P$4 151,38.5 149.24,38.5 138.58,49.16 131.62,49.16 L1.2 131,49.6 121.23,59.38 | 121.23,59.38 121.23,79.29 SUPER_SONIC.1 | v77.79,36.65 73.47,36.65 67.22,30.39 66.6,30.39 RPI_ZERO1.2 | v93.74,47.75 109.42,47.75 120.61,58.94 121.23,59.38
  Bottom 1.5: v77.79,36.65 88.89,47.75 v93.74,47.75
+6V  (via drill 0.35)
  Top 0.8: C8.1 34.89,57.62 36.3,56.21 36.3,52.86 34.89,51.45 34.89,51.1 C7.1 34.45,51.19 v29.69,51.19 | v16.03,37.71 16.03,36.47 15.51,35.95 14.71,35.95 D2.P$1 | v17.36,39.03 17.36,41.58 15.59,43.34 14.8,43.34 14.71,43.43 D2.P$7 14.36,43.79 14.36,51.72 D1.P$1 14.01,52.07 13.21,52.07 12.86,52.42 12.86,58.76 13.48,59.38 14.27,59.38 D1.P$7 14.71,59.56 23.61,59.56 30.48,66.43 34.98,66.43 35.95,67.4 35.95,68.19 37.8,70.04 37.8,71.54 38.15,71.89 50.13,71.89 61.58,60.44 61.58,59.82 64.75,56.65 86.07,56.65 87.31,55.41 87.31,50.39 90.83,46.87 90.83,37.8 85.63,32.6 v85.63,22.64 | v120.08,21.41 91.27,21.41 88.98,19.12 C4.1
  Bottom 0.8: v16.03,37.71 v17.36,39.03 17.71,39.2 v29.69,51.19 | v120.08,21.41 132.59,21.41 133.65,20.35 134.62,20.35 IC1.3 | v85.63,22.64 88.98,19.29 88.98,19.12 C4.1
+7.4V
  Top 1.5: MOSFET2.2 111.27,6.43 113.56,6.43 115.76,8.63 119.11,8.63 121.31,6.43 MOSFET1.2 122.11,6.34 135.76,6.34 BATTERY.1 136.47,6.43 138.67,8.63 144.48,8.63 152.32,16.48 SWITCH_2MS1T2B4M2QES1.P$2
BNO_INT  (via drill 0.35)
  Top 0.2: v93.39,45.9 93.39,45.37 94.27,44.49 R4.2 | BNO1.P$14 84.4,50.3 84.4,49.95 88.01,46.34 v89.42,46.34 89.33,46.25 89.33,40.7 83.61,34.98 73.83,34.98 68.54,29.69 v68.54,27.14 | v61.67,26.34 51.1,26.34 49.69,27.75 48.81,27.75 RPI_ZERO1.15
  Bottom 0.2: v89.42,46.34 92.94,46.34 v93.39,45.9 | v61.67,26.34 62.99,25.02 66.43,25.02 v68.54,27.14
BNO_RESET
  Top 0.2: BNO1.P$11 82.9,50.3 82.9,49.51 87.75,44.67 R2.2 87.84,44.58 88.98,43.43 88.98,40.88 83.43,35.33 73.65,35.33 67.4,29.07 56.03,29.07 54.8,27.84 53.92,27.84 RPI_ZERO1.11
CAP
  Top 0.2: BNO1.P$9 81.84,50.3 81.84,46.25 80.26,44.67 C9.1
FIN1
  Top 0.2: R8.1 27.05,50.57 27.05,31.8 28.46,30.39 RPI_ZERO1.32
FIN2
  Top 0.2: R17.1 30.48,14.01 30.48,17.97 31.54,19.03 31.54,22.2 25.99,27.75 RPI_ZERO1.33
GND  (15 unrouted)
  pour Bottom: 0,0 160,0 160,100 0,100
  pour Top: 0,0 160,0 160,100 0,100
GPS_RESET  (via drill 0.35)
  Top 0.2: 41.49,59.38 41.49,60.52 v36.3,65.72 | 41.49,59.38 41.49,58.41 GPS1.P$32 | v34.62,67.4 33.65,67.4 33.21,67.84 R10.1 | v40.44,41.14 40.97,41.14 49.95,32.16 49.95,30.04 51.27,28.72 51.27,27.84 RPI_ZERO1.13 | v40.61,43.43 40.61,48.1 39.56,49.16 39.56,59.2 39.73,59.38 41.49,59.38
  Bottom 0.2: v34.62,67.4 v36.3,65.72 | v40.44,41.14 40.44,43.26 v40.61,43.43
GPS_RXD  (via drill 0.35)
  Top 0.2: 47.05,59.38 47.05,66.25 45.72,67.57 R9.2 | 47.05,59.38 47.05,58.41 GPS1.P$25 | v54.01,50.92 54.01,35.33 58.94,30.39 RPI_ZERO1.8 | v52.6,52.33 52.6,57.27 50.48,59.38 47.05,59.38
  Bottom 0.2: v52.6,52.33 v54.01,50.92
GPS_TXD  (via drill 0.35)
  Top 0.2: R7.2 39.38,67.57 46.25,60.7 46.25,58.41 GPS1.P$26 46.43,58.32 46.43,57.79 46.69,57.53 47.93,57.53 48.63,56.83 v48.63,51.19 | v51.19,48.63 51.89,47.93 51.89,36.91 56.38,32.42 56.38,30.39 RPI_ZERO1.10
  Bottom 0.2: v48.63,51.19 v51.19,48.63
MOSFET1  (via drill 0.35)
  Top 0.2: v79.47,36.03 79.47,36.47 74.27,41.67 72.24,41.67 R12.1 72.15,41.67 62.64,32.16 62.11,32.16 60.7,33.57 v56.74,33.57 | v87.57,31.8 89.95,29.43 105.63,29.43 106.6,30.39 R15.2 | v40.26,33.57 37.44,30.75 37.44,30.04 36.56,29.16 33.3,29.16 31.98,27.84 31.01,27.84 RPI_ZERO1.29
  Bottom 0.2: v79.47,36.03 80.17,36.74 82.64,36.74 v87.57,31.8 | v56.74,33.57 v40.26,33.57
MOSFET2  (via drill 0.35)
  Top 0.2: v80.44,36.03 73.65,42.82 71.1,42.82 70.13,41.85 65.9,41.85 R13.1 | v53.56,16.48 52.86,15.77 40.79,15.77 28.81,27.75 28.54,27.75 RPI_ZERO1.31 | v54.53,17.44 63.52,26.43 77.26,26.43 81.23,30.39 R14.2
  Bottom 0.2: v80.44,36.03 80.44,31.36 81.32,30.48 R14.2 | v54.53,17.44 v53.56,16.48
MOTOR11  (via drill 0.35)
  Top 0.8: v16.03,44.23 16.03,52.16 15.15,53.04 14.36,53.04 D1.P$2 | v9.87,38.06 9.87,27.75 29.69,7.93 v62.11,7.93 | v63.08,8.9 77.18,8.9 81.58,4.49 91.36,4.49 93.21,6.34 MOTOR1.1
  Bottom 0.8: v9.87,38.06 v16.03,44.23 | v63.08,8.9 v62.11,7.93
MOTOR12  (via drill 0.35)
  Top 0.8: v15.77,57.62 15.24,58.15 14.36,58.15 D1.P$6 | v5.73,47.57 5.73,44.31 4.76,43.34 4.76,31.45 34.45,1.76 95.85,1.76 v98.58,4.49
  Bottom 0.8: v5.73,47.57 v15.77,57.62 | v98.58,4.49 97.7,5.37 97.7,5.46 97.26,5.9 97.26,6.34 MOTOR1.2
MOTOR21  (via drill 0.35)
  Top 0.8: v13.21,36.65 13.65,37.09 14.62,37.09 D2.P$2 | v13.21,34.71 13.21,33.21 16.83,29.6 16.83,22.2 30.13,8.9 v61.14,8.9 | v62.11,9.87 79.64,9.87 83.08,6.43 MOTOR2.1
  Bottom 0.8: v13.21,34.71 v13.21,36.65 | v62.11,9.87 v61.14,8.9
MOTOR22
  Top 0.8: D2.P$6 14.62,42.29 13.83,42.29 11.89,44.23 11.89,59.2 19.82,67.13 27.14,67.13 32.86,72.86 50.57,72.86 62.55,60.88 62.55,60.26 65.19,57.62 86.51,57.62 88.28,55.85 88.28,50.83 91.8,47.31 91.8,37.35 86.6,32.16 86.6,6.87 87.04,6.43 MOTOR2.2
N$1
  Top 0.2: R1.2 101.49,41.58 110.48,41.58 119.46,50.57 128.01,50.57 152.24,26.34 155.32,26.34 155.94,25.73 155.94,17.53 154.97,16.56 SWITCH_2MS1T2B4M2QES1.P$3
N$2
  Top 0.8: SI8050S1.P$2 151.53,41.14 149.86,41.14 141.84,49.16 L1.1 141.58,49.51 141.58,70.92 DIODE_1.1.P$2
N$3
  Top 0.2: R11.1 112.94,13.92 107.04,13.92 95.59,2.47 68.54,2.47 52.33,18.68 51.72,18.68 43.79,26.61 43.17,26.61 42.38,27.4 42.38,29.16 41.23,30.31 RPI_ZERO1.22
N$4
  Top 1.5: IC2.3 123.34,65.11 132.5,65.11 140.61,73.21 145.19,73.21 152.32,66.08 C3.+ 152.85,65.46 155.5,62.81 155.5,42.82 SI8050S1.P$1 | 121.31,15.59 131.09,25.37 134.62,25.37 IC1.1 | 121.31,15.59 98.76,15.59 95.32,19.03 C5.1 | SWITCH_2MS1T2B4M2QES1.P$1 149.86,16.48 147.48,16.48 143.34,12.33 122.55,12.33 121.49,13.39 121.49,14.89 121.31,15.59
  Bottom 1.5: C1.1 82.64,19.03 84.75,16.91 93.12,16.91 95.24,19.03 C5.1 | SI8050S1.P$1 155.5,42.82 155.06,42.82 154.97,42.91 153.21,42.91 152.41,43.7 150.83,43.7 134.62,27.49 134.62,26.78 134.53,26.69 134.53,26.17 134.62,26.08 134.62,25.46 IC1.1
N$5
  Top 0.2: R11.2 123.25,14.01 143.51,14.01 154.88,25.37 LED1.A
N$6  (via drill 0.35)
  Top 0.2: v120.78,17 120.78,21.67 118.85,23.61 118.85,33.48 120.61,35.24 120.61,35.5 Q1.D
  Bottom 0.2: v120.78,17 120.78,10.4 117.44,7.05 117.44,6.43 MOSFET1.1
N$7
  Top 0.2: D1.P$3 14.36,54.27 26.17,54.27 26.96,53.48 R8.2
N$8  (via drill 0.35)
  Top 0.2: v121.49,20 122.46,20.97 122.46,47.4 120.7,49.16 120.7,49.51 Q2.D
  Bottom 0.2: v121.49,20 107.92,6.43 107.31,6.43 MOSFET2.1
N$9
  Top 0.2: D1.P$5 14.36,56.91 23.52,56.91 26.96,60.35 R16.1
N$10
  Top 0.2: R15.1 96.56,30.48 105.37,30.48 112.94,38.06 120.61,38.06 Q1.G
N$11
  Top 0.2: R14.1 91.45,33.65 100.26,42.46 100.26,42.55 101.05,43.34 111.71,43.34 120.43,52.07 120.61,52.07 Q2.G
N$12
  Top 0.2: D2.P$3 14.71,38.41 16.3,38.41 19.65,35.06 19.65,21.94 R17.2
N$14
  Top 0.2: D2.P$5 14.71,40.97 15.06,40.97 16.65,39.38 16.65,38.76 22.2,33.21 22.2,25.46 27.57,20.09 R18.1
N$15
  Top 0.2: R19.2 37.09,81.05 120.43,81.05 120.61,81.23 122.28,81.23 123.69,79.82 SUPER_SONIC.2
N$16
  Top 0.2: R21.2 37.09,87.92 118.58,87.92 126.25,80.26 SUPER_SONIC.3
RIN1
  Top 0.2: R16.2 27.05,57.53 27.05,56.03 28.98,54.09 28.98,50.92 38.06,41.85 40.7,41.85 41.05,41.49 42.73,41.49 53.83,30.39 RPI_ZERO1.12
RIN2
  Top 0.2: R18.2 30.39,20.09 30.39,20.79 23.43,27.75 RPI_ZERO1.35
SCL  (via drill 0.35)
  Top 0.2: v89.25,52.07 90.13,52.07 90.66,52.6 R6.1 | BNO1.P$19 84.93,52.6 85.37,52.6 86.34,51.63 v86.34,51.45 86.34,50.39 90.13,46.6 90.13,38.06 82.2,30.13 82.2,30.04 77.88,25.73 v63.87,25.73 | v52.07,17.97 50.39,16.3 43.34,16.3 S1.P$4
  Bottom 0.2: v86.34,51.45 88.63,51.45 v89.25,52.07 | v52.07,17.97 61.41,27.31 61.41,27.75 RPI_ZERO1.5 61.49,27.4 62.2,27.4 v63.87,25.73
SDA  (via drill 0.35)
  Top 0.2: v85.72,55.68 84.93,54.89 84.93,53.48 BNO1.P$20 | v87.75,57.71 89.42,57.71 90.48,58.76 R5.1 | v51.01,18.41 49.6,17 43.34,17 S1.P$3 | v51.98,19.38 55.68,19.38 64.05,27.75 RPI_ZERO1.3
  Bottom 0.2: v85.72,55.68 v87.75,57.71 88.72,57.71 89.16,57.27 89.16,55.24 65.28,31.36 65.28,31.1 65.37,31.01 65.37,30.84 65.28,30.75 65.28,29.87 65.37,29.78 65.37,29.51 64.05,28.19 64.05,27.84 RPI_ZERO1.3 | v51.98,19.38 v51.01,18.41
SONIC_ECHO
  Top 0.2: D3.C 65.37,61.05 63.34,61.05 50.66,73.74 42.99,73.74 28.81,87.92 26.96,87.92 R21.1 26.96,87.84 26.96,87.39 6.43,66.87 6.43,42.46 18.24,30.66 18.24,30.39 RPI_ZERO1.40
SONIC_TRIG  (via drill 0.35)
  Top 0.2: R19.1 26.87,80.96 26.43,80.52 26.43,69.07 R20.1 26.34,68.98 25.2,67.84 19.21,67.84 16.03,64.67 12.95,64.67 9.07,60.79 9.07,46.08 13.21,41.94 v13.21,38.15
  Bottom 0.2: v13.21,38.15 20.79,30.57 20.79,30.39 RPI_ZERO1.38

### Text on the board
tDocu: FTE CanSat